# Altium schematic sheet Lasers.SchDoc
size Letter
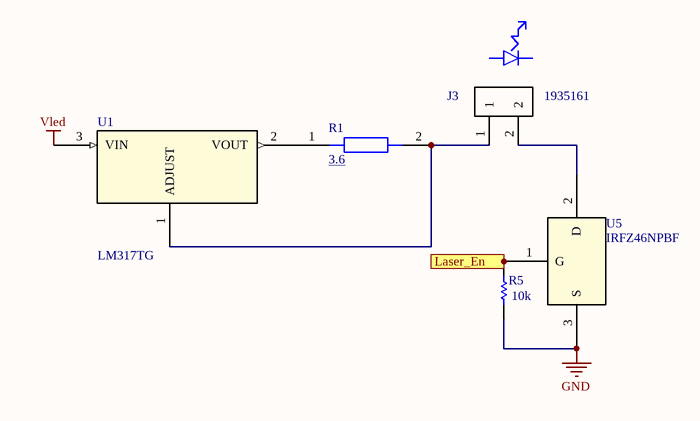
[diagram p0: Lasers.SchDoc]

## Parts
J3  1935161  [PHOENIX_1935161]
R1  3.6  [3.6_R]
R5  value 10k  [AXIAL-0.3]  (hidden comment: Res1)
U1  LM317TG  [TO-220AB]
U5  IRFZ46NPBF  [TO-220AB]

## Ports
Laser_En (in)

## Nets
GND: R5.1 U5.3(S)
Vled: U1.3(VIN)
Laser_En: R5.2 U5.1(G) ; port Laser_En
NetJ3_1: J3.1 R1.2 U1.1(ADJUST)
NetJ3_2: J3.2 U5.2(D)
NetR1_1: R1.1 U1.2(VOUT)

## Notes on the sheet
- Title
- Size:
- Date:
- Letter
- Number:
- Time:
- Revision:
- Sheet
- of
- File:

## Library data of the parts
J3 = 1935161: Conn Terminal Blocks 2 POS 5mm Solder ST Thru-Hole 16A; MF: Phoenix Contact; Digi-Key_Part_Number: 277-1667-ND; Package: None; SnapEDA_Link: https://www.snapeda.com/parts/1935161/Phoenix%20Contact/view-part/?ref=snap; MP: 1935161; Digi-Key_Purchase_URL: https://www.digikey.com/product-detail/en/phoenix-contact/1935161/277-1667-ND/568614?utm_source=snapeda&utm_medium=aggregator&utm_campaign=symbol; Value: *
R5 = Res1: Resistor; Published: 8-Jun-2000; LatestRevisionDate: 17-Jul-2002; LatestRevisionNote: Re-released for DXP Platform.; PackageReference: AXIAL-0.3; Publisher: Altium Limited
U1 = LM317TG: Imported; Vendor: ON Semiconductor; Built_By: EMA_UL_Team; C: Copyright (C) 2015 Accelerated Designs. All rights reserved; Manufacturer_Part_Number: LM317TG; RefDes: RefDes; Type: DEV; Value: Value
U5 = IRFZ46NPBF: Imported; Vendor: LITE-ON; Built_By: EMA_UL_Team; C: Copyright (C) 2015 Accelerated Designs. All rights reserved; Manufacturer_Part_Number: IRFZ46NPBF; RefDes: RefDes; Type: DEV; Value: Value